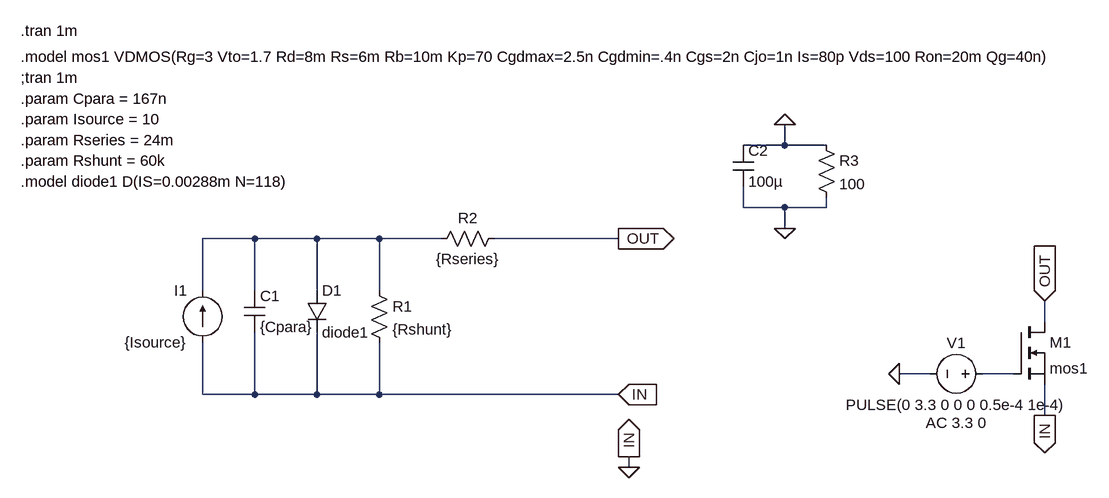
[diagram p0: schematic module-simple-72x1.asc]
module-simple-72x1.asc, the LTspice schematic file:
Version 4
SHEET 1 1844 680
WIRE 880 -112 880 -144
WIRE 880 -112 816 -112
WIRE 944 -112 880 -112
WIRE 816 -16 816 -48
WIRE 880 -16 816 -16
WIRE 944 -16 944 -32
WIRE 944 -16 880 -16
WIRE 880 16 880 -16
WIRE 64 32 -16 32
WIRE 160 32 64 32
WIRE 256 32 160 32
WIRE 352 32 256 32
WIRE 624 32 432 32
WIRE -16 112 -16 32
WIRE 64 112 64 32
WIRE 160 112 160 32
WIRE 256 112 256 32
WIRE 1280 160 1280 128
WIRE 1104 240 1056 240
WIRE 1232 240 1184 240
WIRE -16 272 -16 192
WIRE 64 272 64 176
WIRE 64 272 -16 272
WIRE 160 272 160 176
WIRE 160 272 64 272
WIRE 256 272 256 192
WIRE 256 272 160 272
WIRE 624 272 256 272
WIRE 1280 304 1280 256
WIRE 640 384 640 368
FLAG 624 272 IN
IOPIN 624 272 In
FLAG 624 32 OUT
IOPIN 624 32 Out
FLAG 640 384 0
FLAG 640 368 IN
IOPIN 640 368 Out
FLAG 1280 128 OUT
IOPIN 1280 128 In
FLAG 1280 304 IN
IOPIN 1280 304 Out
FLAG 1056 240 0
FLAG 880 16 0
FLAG 880 -144 0
SYMBOL current -16 192 R180
WINDOW 0 24 80 Left 2
WINDOW 3 24 0 Left 2
WINDOW 123 0 0 Left 2
WINDOW 39 0 0 Left 2
SYMATTR InstName I1
SYMATTR Value {Isource}
SYMBOL cap 48 112 R0
SYMATTR InstName C1
SYMATTR Value {Cpara}
SYMBOL diode 144 112 R0
SYMATTR InstName D1
SYMATTR Value diode1
SYMBOL res 240 96 R0
SYMATTR InstName R1
SYMATTR Value {Rshunt}
SYMBOL res 448 16 R90
WINDOW 0 0 56 VBottom 2
WINDOW 3 32 56 VTop 2
SYMATTR InstName R2
SYMATTR Value {Rseries}
SYMBOL nmos 1232 160 R0
SYMATTR InstName M1
SYMATTR Value mos1
SYMBOL voltage 1200 240 R90
WINDOW 0 -32 56 VBottom 2
WINDOW 3 32 56 VTop 2
WINDOW 123 60 56 VTop 2
WINDOW 39 0 0 Left 2
SYMATTR InstName V1
SYMATTR Value PULSE(0 3.3 0 0 0 0.5e-4 1e-4)
SYMATTR Value2 AC 3.3 0
SYMBOL cap 800 -112 R0
SYMATTR InstName C2
SYMATTR Value 100µ
SYMBOL res 928 -128 R0
SYMATTR InstName R3
SYMATTR Value 100
TEXT -296 -56 Left 2 !.model diode1 D(IS=0.00288m N=118)
TEXT -296 -216 Left 2 !;tran 1m
TEXT -296 -88 Left 2 !.param Rshunt = 60k
TEXT -296 -120 Left 2 !.param Rseries = 24m
TEXT -296 -184 Left 2 !.param Cpara = 167n
TEXT -296 -152 Left 2 !.param Isource = 10
TEXT -296 -248 Left 2 !.model mos1 VDMOS(Rg=3 Vto=1.7 Rd=8m Rs=6m Rb=10m Kp=70 Cgdmax=2.5n Cgdmin=.4n Cgs=2n Cjo=1n Is=80p Vds=100 Ron=20m Qg=40n)
TEXT -296 -288 Left 2 !.tran 1m

The netlist it stands for:
* module-simple-72x1.asc
I1 0 N001 {Isource}
C1 N001 0 {Cpara}
D1 N001 0 diode1
R1 N001 0 {Rshunt}
R2 OUT N001 {Rseries}
M1 OUT N002 0 0 mos1
V1 N002 0 PULSE(0 3.3 0 0 0 0.5e-4 1e-4) AC 3.3 0
C2 0 0 100µ
R3 0 0 100
.model D D
.lib standard.dio
.model NMOS NMOS
.model PMOS PMOS
.lib standard.mos
.model diode1 D(IS=0.00288m N=118)
;tran 1m
.param Rshunt = 60k
.param Rseries = 24m
.param Cpara = 167n
.param Isource = 10
.model mos1 VDMOS(Rg=3 Vto=1.7 Rd=8m Rs=6m Rb=10m Kp=70 Cgdmax=2.5n Cgdmin=.4n Cgs=2n Cjo=1n Is=80p Vds=100 Ron=20m Qg=40n)
.tran 1m
.backanno
.end